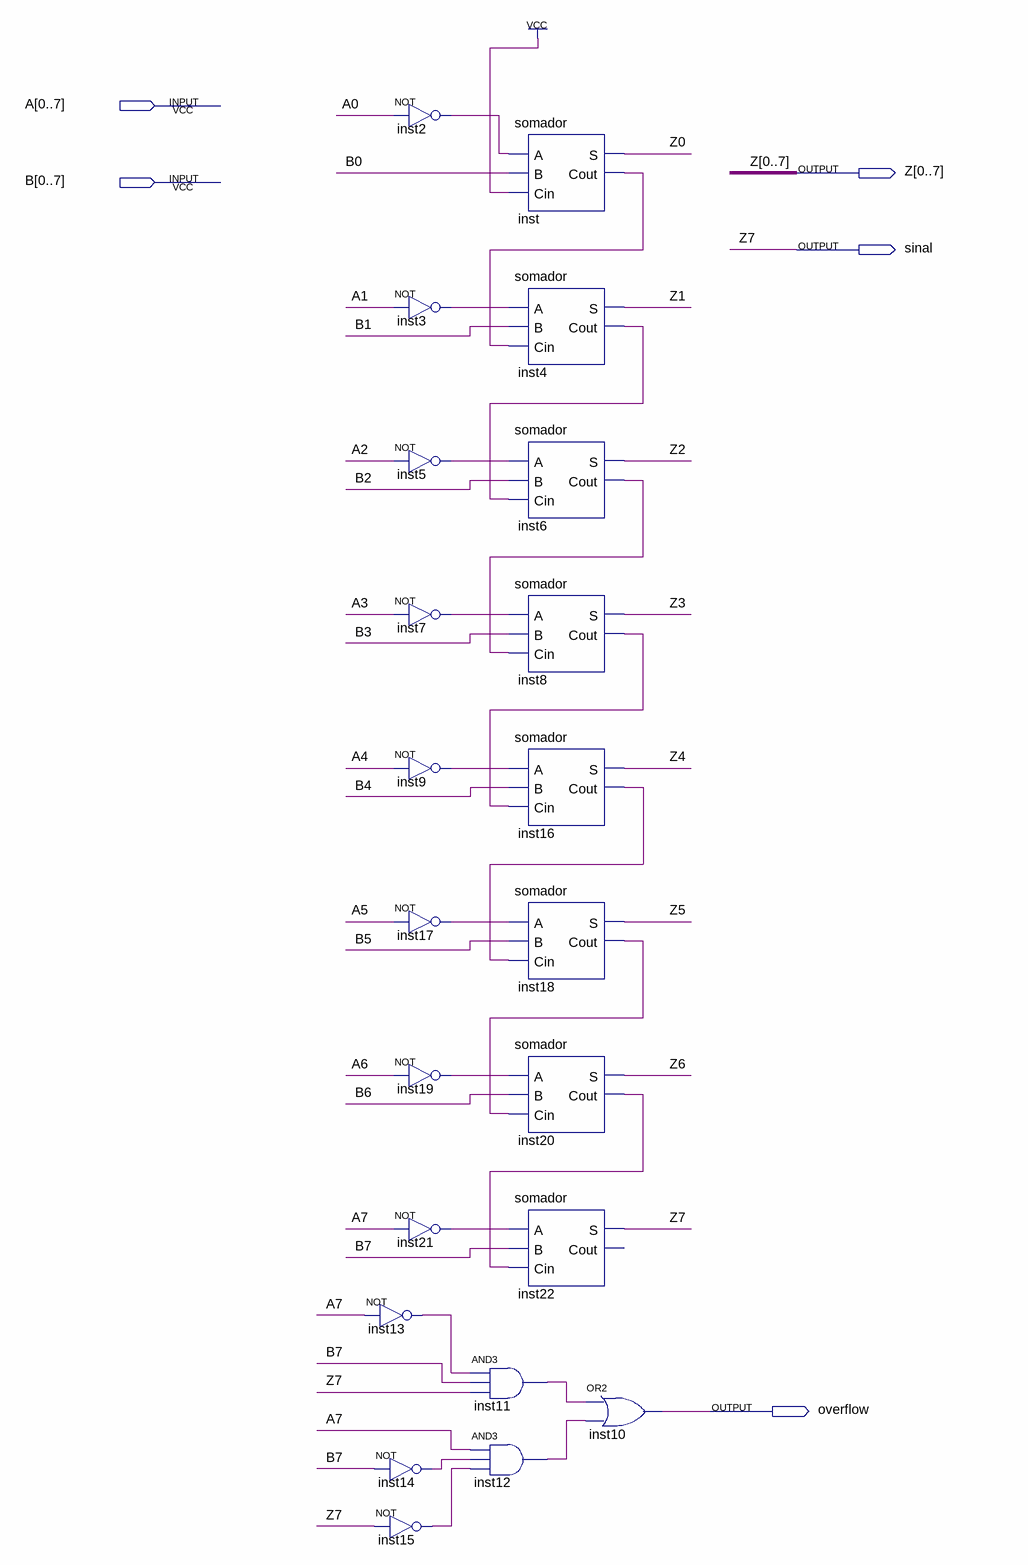
[diagram p0: schematic sheet]
// Quartus schematic subtrator8bits_B_A.bdf as structural Verilog: 22 symbols, 5 pins
module subtrator8bits_B_A (
  input  [0:7] A,
  input  [0:7] B,
  output [0:7] Z,
  output sinal,
  output overflow
);

  wire inst2_out, inst3_out, inst4_cout, inst5_out, inst6_cout, inst7_out, inst8_cout, inst9_out, inst11_out,
       inst12_out, inst13_out, inst14_out, inst15_out, inst16_cout, inst17_out, inst18_cout, inst19_out,
       inst20_cout, inst21_out, inst_cout;

  not inst2 (inst2_out, A[0]);
  not inst3 (inst3_out, A[1]);
  not inst5 (inst5_out, A[2]);
  not inst7 (inst7_out, A[3]);
  not inst9 (inst9_out, A[4]);
  not inst17 (inst17_out, A[5]);
  not inst19 (inst19_out, A[6]);
  not inst21 (inst21_out, A[7]);
  not inst13 (inst13_out, A[7]);
  not inst14 (inst14_out, B[7]);
  not inst15 (inst15_out, sinal);
  and inst11 (inst11_out, inst13_out, B[7], sinal);
  and inst12 (inst12_out, A[7], inst14_out, inst15_out);
  somador inst (.A(inst2_out), .B(B[0]), .Cin(1'b1), .S(Z[0]), .Cout(inst_cout));
  somador inst4 (.A(inst3_out), .B(B[1]), .Cin(inst_cout), .S(Z[1]), .Cout(inst4_cout));
  somador inst6 (.A(inst5_out), .B(B[2]), .Cin(inst4_cout), .S(Z[2]), .Cout(inst6_cout));
  somador inst8 (.A(inst7_out), .B(B[3]), .Cin(inst6_cout), .S(Z[3]), .Cout(inst8_cout));
  somador inst16 (.A(inst9_out), .B(B[4]), .Cin(inst8_cout), .S(Z[4]), .Cout(inst16_cout));
  somador inst18 (.A(inst17_out), .B(B[5]), .Cin(inst16_cout), .S(Z[5]), .Cout(inst18_cout));
  somador inst20 (.A(inst19_out), .B(B[6]), .Cin(inst18_cout), .S(Z[6]), .Cout(inst20_cout));
  somador inst22 (.A(inst21_out), .B(B[7]), .Cin(inst20_cout), .S(sinal));  // open: Cout
  or inst10 (overflow, inst11_out, inst12_out);

  assign Z[7] = sinal;

  // Other names for the same wires on the sheet: Z7 = sinal
endmodule
